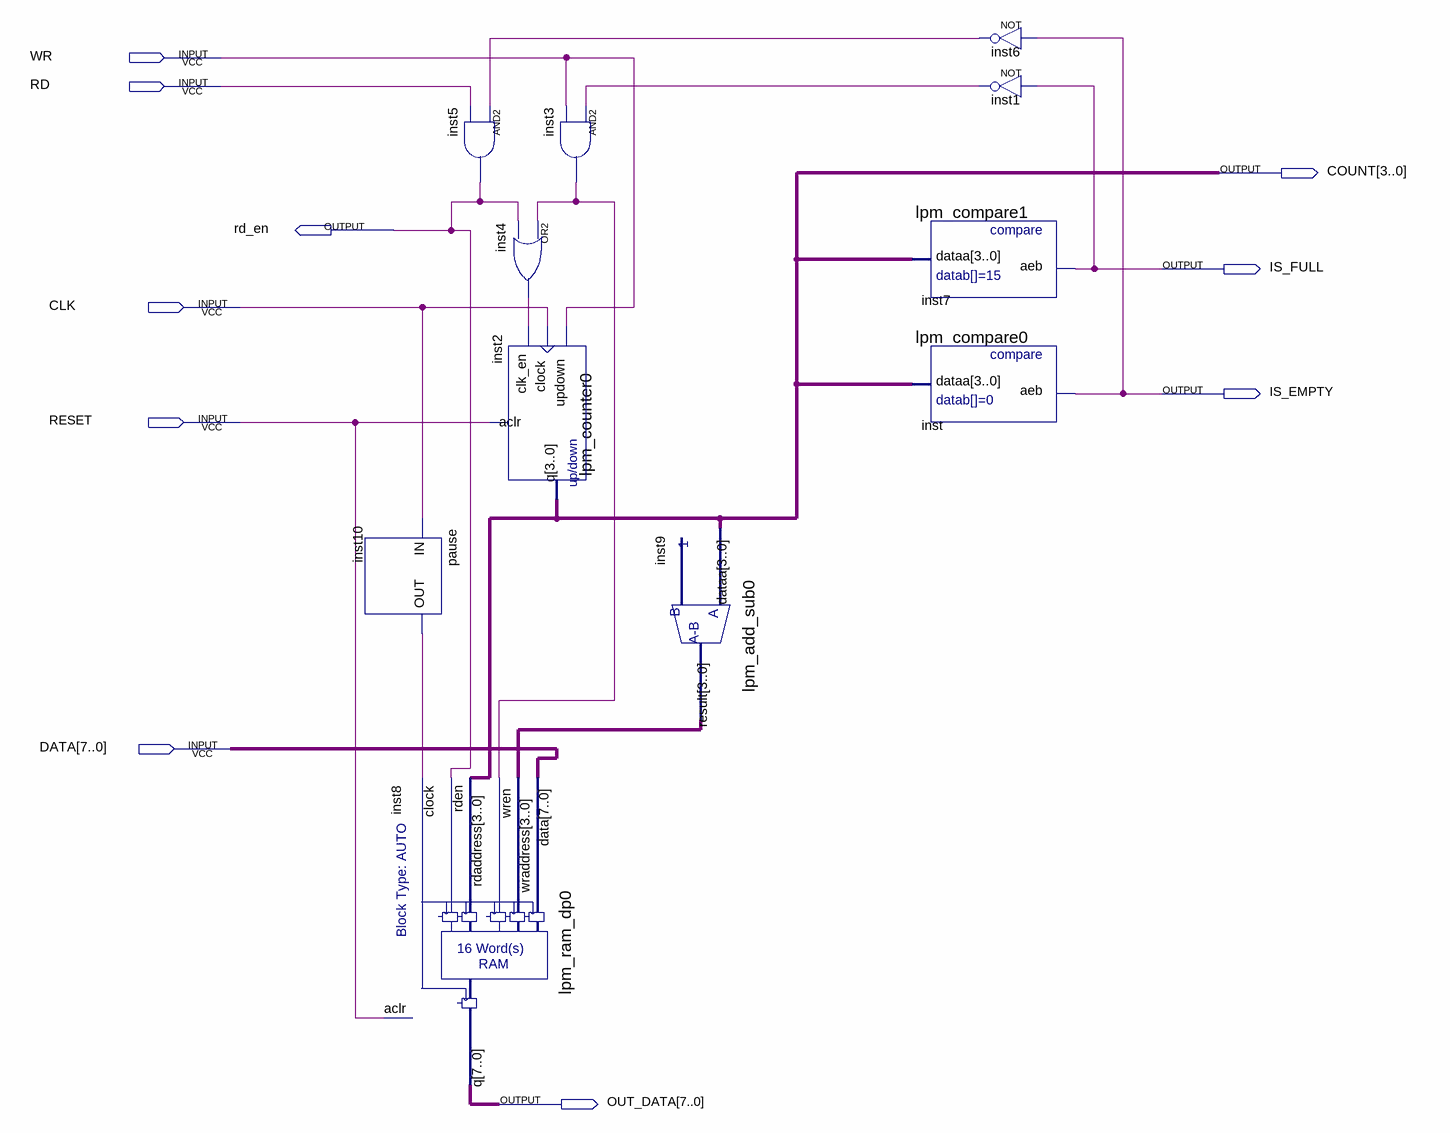
[diagram p0: schematic sheet]
// Quartus schematic lifo_graph.bdf as structural Verilog: 11 symbols, 10 pins
module lifo_graph (
  input  WR,
  input  RD,
  input  CLK,
  input  RESET,
  input  [7:0] DATA,
  output [3:0] COUNT,
  output rd_en,
  output IS_FULL,
  output IS_EMPTY,
  output [7:0] OUT_DATA
);

  wire inst1_out, inst3_out, inst4_out, inst6_out, inst10_out;
  wire [3:0] inst9_result;

  pause inst10 (.IN(CLK), .OUT(inst10_out));
  lpm_ram_dp0 inst8 (
    .data(DATA), .wraddress(inst9_result), .wren(inst3_out), .rdaddress(COUNT), .rden(rd_en),
    .clock(inst10_out), .aclr(RESET), .q(OUT_DATA));
  and inst5 (rd_en, inst6_out, RD);
  and inst3 (inst3_out, inst1_out, WR);
  or inst4 (inst4_out, inst3_out, rd_en);
  lpm_counter0 inst2 (.updown(WR), .clock(CLK), .clk_en(inst4_out), .aclr(RESET), .q(COUNT));
  lpm_add_sub0 inst9 (.dataa(COUNT), .result(inst9_result));
  lpm_compare1 inst7 (.dataa(COUNT), .aeb(IS_FULL));
  lpm_compare0 inst (.dataa(COUNT), .aeb(IS_EMPTY));
  not inst6 (inst6_out, IS_EMPTY);
  not inst1 (inst1_out, IS_FULL);
endmodule
